# Altium schematic sheet Fuse.schdoc
size 124 x 99 mm
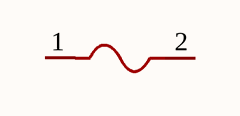
[diagram p0: Fuse.schdoc]

## Parts
F?  0437003.WR  [F1206]  (value not drawn)

## Nets

Not connected (* = marked no-connect by the designer): F? 1 2

## Library data of the parts
F? = 0437003.WR: Manufacturer: Littelfuse(美国力特); Add into BOM: yes; Type: SMD Fuse; Current Rating: 3A; Voltage Rating  (AC): 32V; Voltage Rating (DC): 35V; Breaking Capacity: 50A; Symbol: 0437003.WR; Device: 0437003.WR; LCSC Part Name: 32V贴片式保险丝; Supplier Part: C99539; Manufacturer Part: 0437003.WR; Supplier Footprint: 1206; JLCPCB Part Class: Extended Part; Datasheet: https://atta.szlcsc.com/upload/public/pdf/source/20170322/1490151740362.pdf; Supplier: LCSC; Convert to PCB: yes; Operating Temperature: -55℃~+150℃